# EAGLE design esp32 drone (EAGLE 9.5.1)
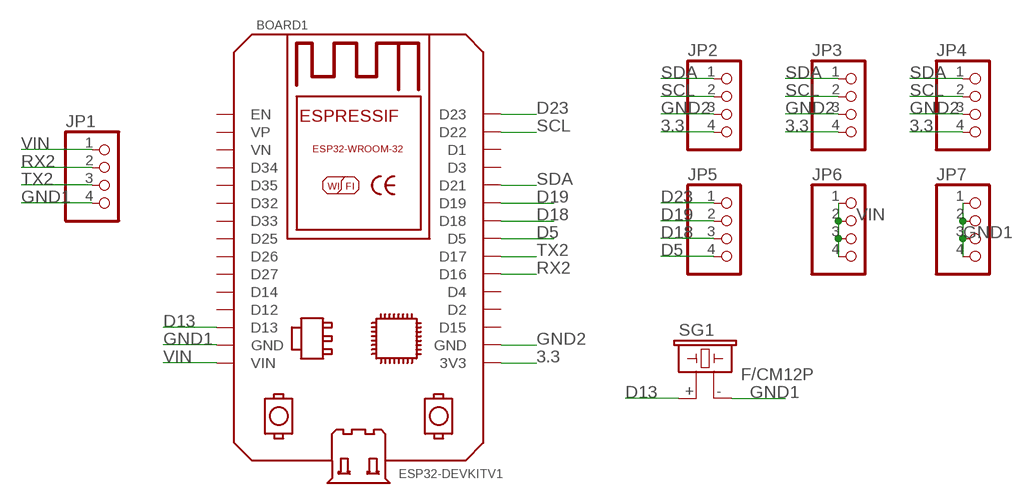
[diagram p0: schematic, sheet 1]

## Parts
BOARD1  ESP32DEVKITV1  [ESP32-DEVKITV1]
JP1  PINHD-1X4  [1X04]
JP2  PINHD-1X4  [1X04]
JP3  PINHD-1X4  [1X04]
JP4  PINHD-1X4  [1X04]
JP5  PINHD-1X4  [1X04]
JP6  PINHD-1X4  [1X04]
JP7  PINHD-1X4  [1X04]
SG1  F/CM12P  [F/CM12P]

## Nets
3.3: BOARD1.3V3 JP2.4 JP3.4 JP4.4
D5: BOARD1.D5 JP5.4
D13: BOARD1.D13 SG1.+
D18: BOARD1.D18 JP5.3
D19: BOARD1.D19 JP5.2
D23: BOARD1.D23 JP5.1
GND1: BOARD1.GND JP1.4 JP7.1 JP7.2 JP7.3 JP7.4 SG1.-
GND2: BOARD1.GND@1(GND) JP2.3 JP3.3 JP4.3
RX2: BOARD1.D16 JP1.2
SCL: BOARD1.D22 JP2.2 JP3.2 JP4.2
SDA: BOARD1.D21 JP2.1 JP3.1 JP4.1
TX2: BOARD1.D17 JP1.3
VIN: BOARD1.VIN JP1.1 JP6.1 JP6.2 JP6.3 JP6.4
Unconnected: BOARD1.D1 BOARD1.D2 BOARD1.D3 BOARD1.D4 BOARD1.D12 BOARD1.D14 BOARD1.D15 BOARD1.D25 BOARD1.D26 BOARD1.D27 BOARD1.D32 BOARD1.D33 BOARD1.D34 BOARD1.D35 BOARD1.EN BOARD1.VN BOARD1.VP

## Library data of the parts
BOARD1 = ESP32-DEVKITV1:ESP32DEVKITV1: https://github.com/shridattdudhat
JP1-JP7 = pinhead:PINHD-1X4: PIN HEADER
SG1 = buzzer:F/CM12P: BUZZER Source: Buerklin; OC_FARNELL: unknown; OC_NEWARK: unknown

## Board
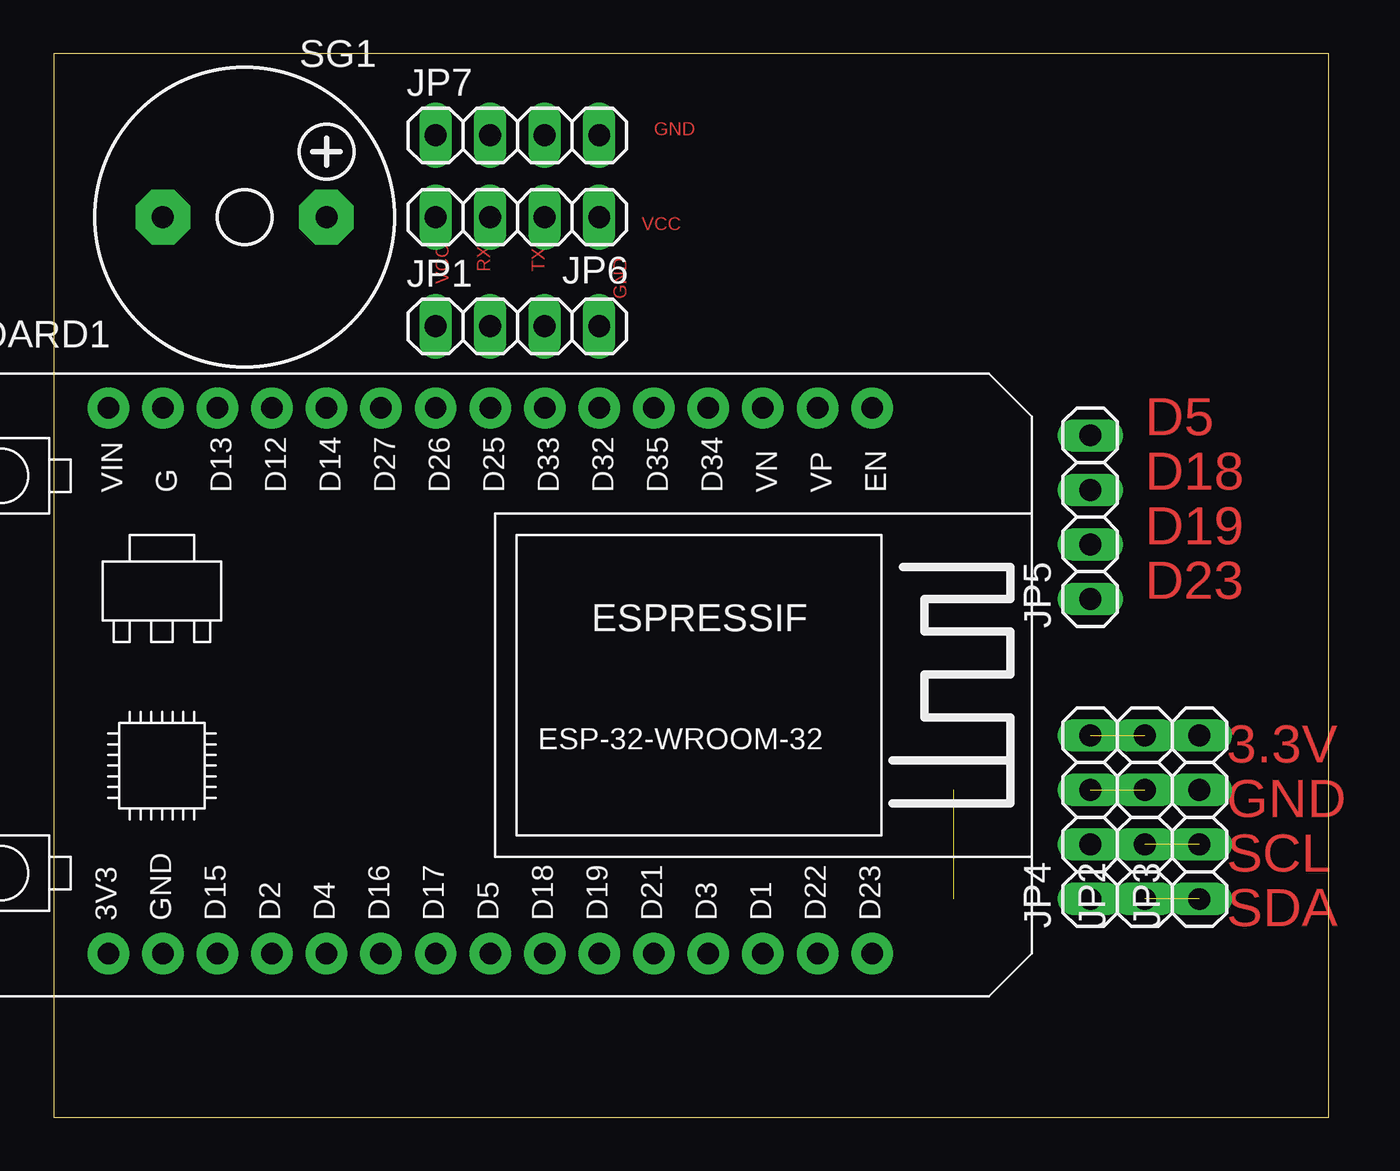
[diagram p1: board, top side]
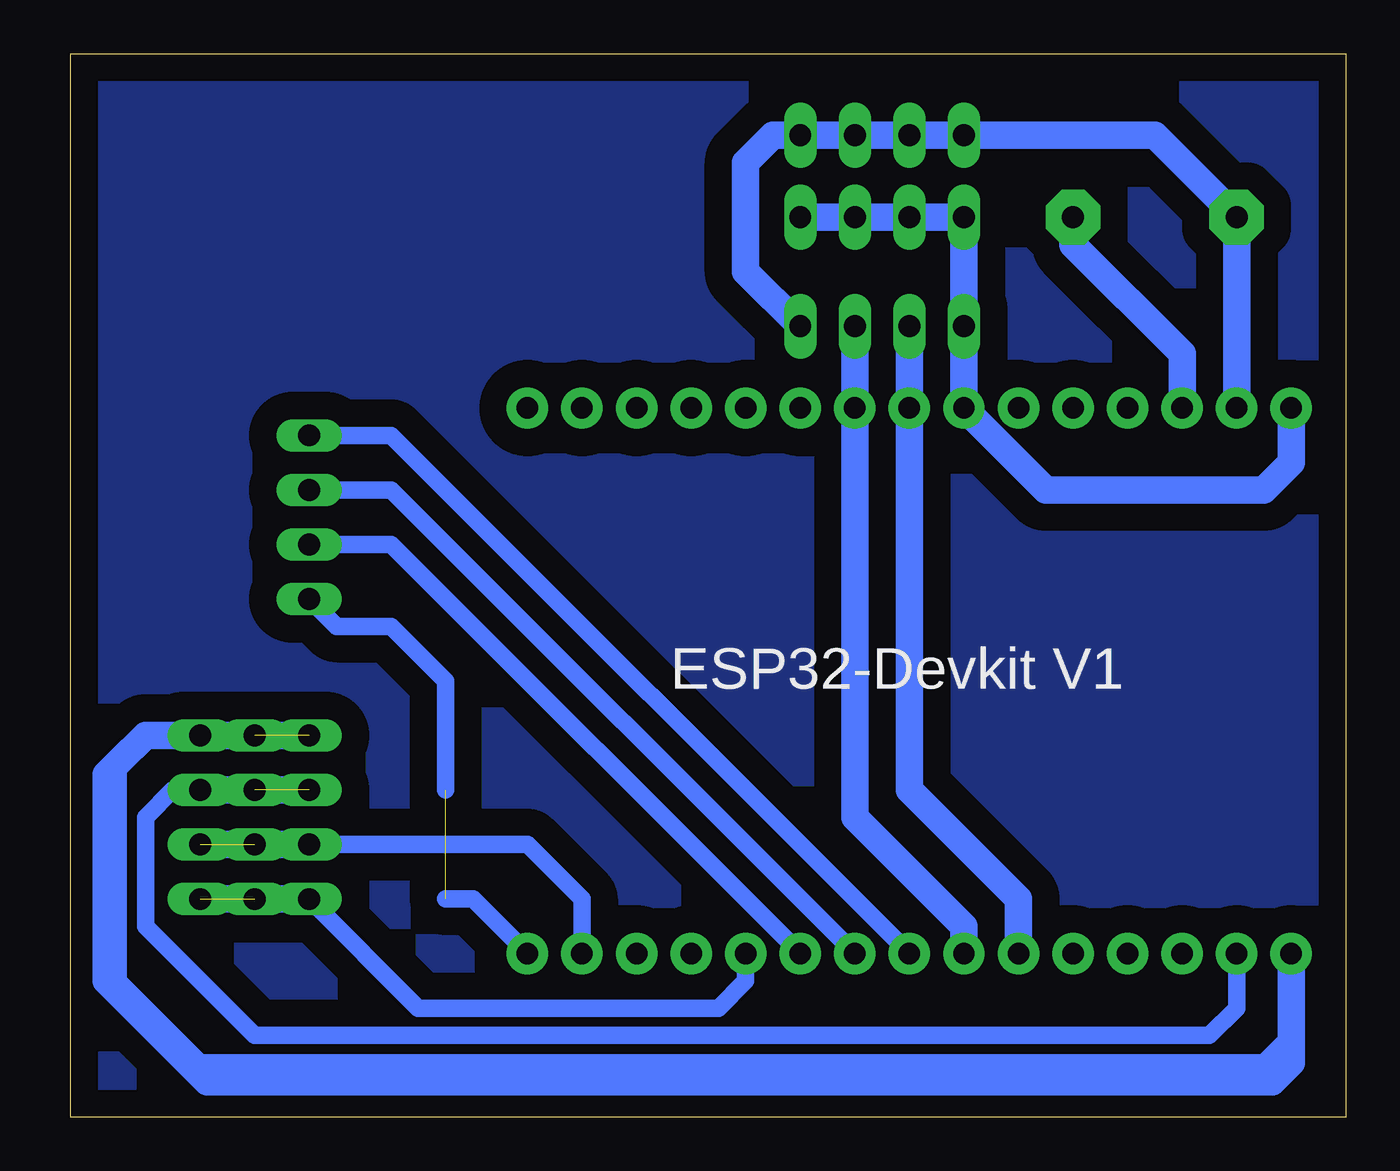
[diagram p2: board, bottom side, seen from below]

Size 59.36 x 49.52 mm. Coordinates in mm from the lower left corner, seen from the top.
Outline: 0,0 59.36,0 59.36,49.52 0,49.52 0,0
Copper layers (1*16): Top 0.035mm / dielectric 1.5mm / Bottom 0.035mm
Design rules "default": minimum track width 6mil, minimum drill 0.35mm, track to track 6mil, track to pad 6mil, pad to pad 6mil, via to via 6mil, smd to smd 6mil, copper to edge 40mil, drill to drill 6mil, minimum pad ring 10mil, minimum via ring 8mil, stop-mask expansion 4mil, vias tented up to drill 0mil, thermal gap 10mil

### Footprints (pad centres in the part's own frame; a part is rotated, then mirrored left to right if it is on the bottom)
ESP32-DEVKITV1 = drill 1 pad 1.93: 3V3 0,0; D1 30.48,0; D2 7.62,0; D3 27.94,0; D4 10.16,0; D5 17.78,0; D12 7.62,25.4; D13 5.08,25.4; D14 10.16,25.4; D15 5.08,0; D16 12.7,0; D17 15.24,0; D18 20.32,0; D19 22.86,0; D21 25.4,0; D22 33.02,0; D23 35.56,0; D25 17.78,25.4; D26 15.24,25.4; D27 12.7,25.4; D32 22.86,25.4; D33 20.32,25.4; D34 27.94,25.4; D35 25.4,25.4; EN 35.56,25.4; GND 2.54,25.4; GND@1 2.54,0; VIN 0,25.4; VN 30.48,25.4; VP 33.02,25.4
1X04 = drill 1.016 long: 1 -3.81,0; 2 -1.27,0; 3 1.27,0; 4 3.81,0
F/CM12P = drill 1.016 pad 2.54 octagon: + 3.81,0; - -3.81,0

### Placement (x,y rotation side)
BOARD1  2.54,7.62 0 top
JP1  21.59,36.83 0 top
JP2  50.8,13.97 90 top
JP3  53.34,13.97 90 top
JP4  48.26,13.97 90 top
JP5  48.26,27.94 90 top
JP6  21.59,41.91 180 top
JP7  21.59,45.72 0 top
SG1  8.89,41.91 0 top

### Tracks (layer width: path | path; a pad name or v marks a point on that pad's centre or on a via)
3.3  (1 unrouted)
  Bottom 0.813: 57.15,16.51 57.15,6.35 53.34,2.54 3.81,2.54 2.54,3.81 BOARD1.3V3
  Bottom 1.27: BOARD1.3V3 2.54,2.54 3.43,1.65 53.01,1.65 57.71,6.35 57.71,15.95 57.15,16.51 55.88,17.78 JP3.4 JP4.4
D5
  Bottom 0.813: BOARD1.D5 44.45,31.75 JP5.4
D13
  Bottom 1.27: BOARD1.D13 7.62,35.56 12.7,40.64 SG1.+
D18
  Bottom 0.813: BOARD1.D18 44.45,29.21 JP5.3
D19
  Bottom 0.813: BOARD1.D19 44.45,26.67 JP5.2
D23  (1 unrouted)
  Bottom 0.813: BOARD1.D23 40.64,10.16 41.91,10.16 | JP5.1 46.99,22.86 44.45,22.86 41.91,20.32 41.91,15.24
GND1
  Bottom 1.27: BOARD1.GND SG1.- 8.89,45.72 JP7.1 JP7.2 JP7.3 JP7.4 26.67,45.72 27.94,44.45 27.94,39.37 JP1.4
GND2  (1 unrouted)
  Bottom 0.813: JP3.3 54.61,15.24 55.88,13.97 55.88,8.89 50.8,3.81 6.35,3.81 5.08,5.08 BOARD1.GND@1
  Bottom 1.27: JP4.3 JP3.3
N$1
  pour Bottom (isolate 1.27): -1.27,49.53 59.69,49.53 60.96,48.26 60.96,1.27 59.69,0 -1.27,0
RX2
  Bottom 1.27: JP1.2 20.32,15.24 15.24,10.16 BOARD1.D16
SCL  (1 unrouted)
  Bottom 0.813: JP4.2 38.1,12.7 35.56,10.16 BOARD1.D22
  Bottom 1.27: JP4.2 JP3.2
SDA  (1 unrouted)
  Bottom 0.813: JP4.1 43.18,5.08 29.21,5.08 27.94,6.35 BOARD1.D21
  Bottom 1.27: JP4.1 JP3.1
TX2
  Bottom 1.27: JP1.3 22.86,13.97 17.78,8.89 BOARD1.D17
VIN
  Bottom 1.27: BOARD1.VIN 2.54,30.48 3.81,29.21 13.97,29.21 17.78,33.02 JP1.1 JP6.4 JP6.3 JP6.2 JP6.1

### Text on the board
Top: GND | VCC | VCC | RX2 | TX2 | GND | D5 | D18 | D19 | D23 | 3.3V | GND | SCL | SDA